# EAGLE design Power Link (EAGLE 9.7.0)
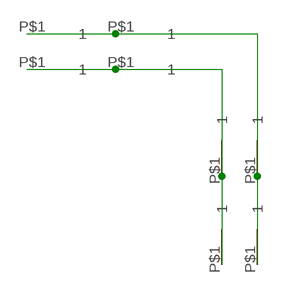
[diagram p0: schematic, sheet 1]

## Parts
PIN1  0945-0-15-20-09-14-11-0  [MILL_MAX_0945_SMD]
PIN2  0945-0-15-20-09-14-11-0  [MILL_MAX_0945_SMD]
PIN3  0945-0-15-20-09-14-11-0  [MILL_MAX_0945_SMD]
PIN4  0945-0-15-20-09-14-11-0  [MILL_MAX_0945_SMD]
PIN5  0945-0-15-20-09-14-11-0  [MILL_MAX_0945_SMD]
PIN6  0945-0-15-20-09-14-11-0  [MILL_MAX_0945_SMD]
PIN7  0945-0-15-20-09-14-11-0  [MILL_MAX_0945_SMD]
PIN8  0945-0-15-20-09-14-11-0  [MILL_MAX_0945_SMD]

## Nets
N$1: PIN1.P$1 PIN3.P$1 PIN5.P$1 PIN7.P$1
N$2: PIN2.P$1 PIN4.P$1 PIN6.P$1 PIN8.P$1

## Library data of the parts
PIN1-PIN8 = MILL_MAX_0945_SMD:0945-0-15-20-09-14-11-0: Surface Mount Spring-Loaded Pin; DATASHEET: https://www.mill-max.com/assets/pdfs/0945.pdf; MANUFACTURER: Mill-Max; MPN: 0945-0-15-20-09-14-11-0

## Board
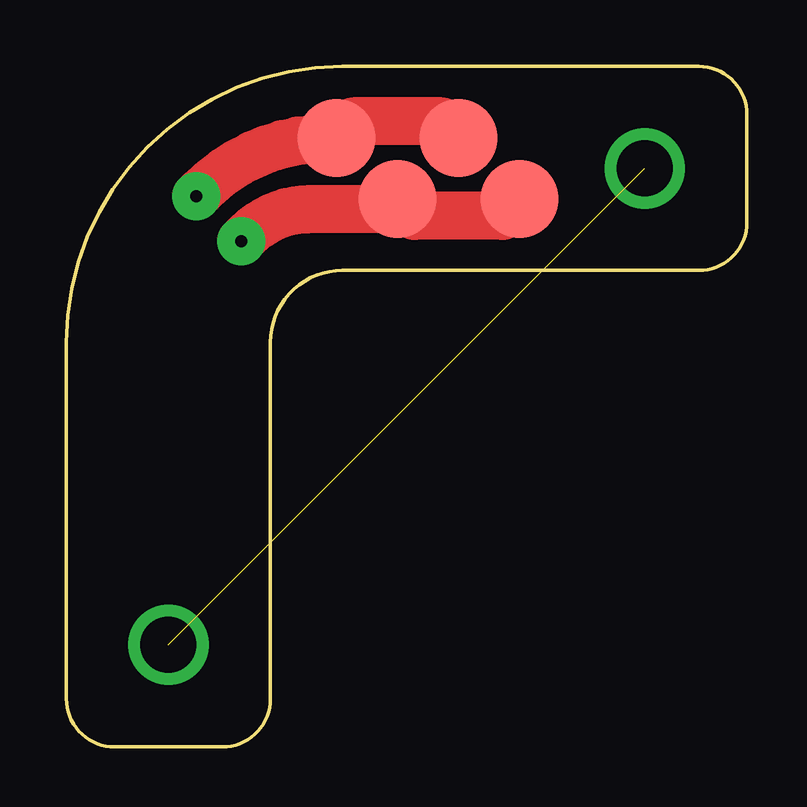
[diagram p1: board, top side]
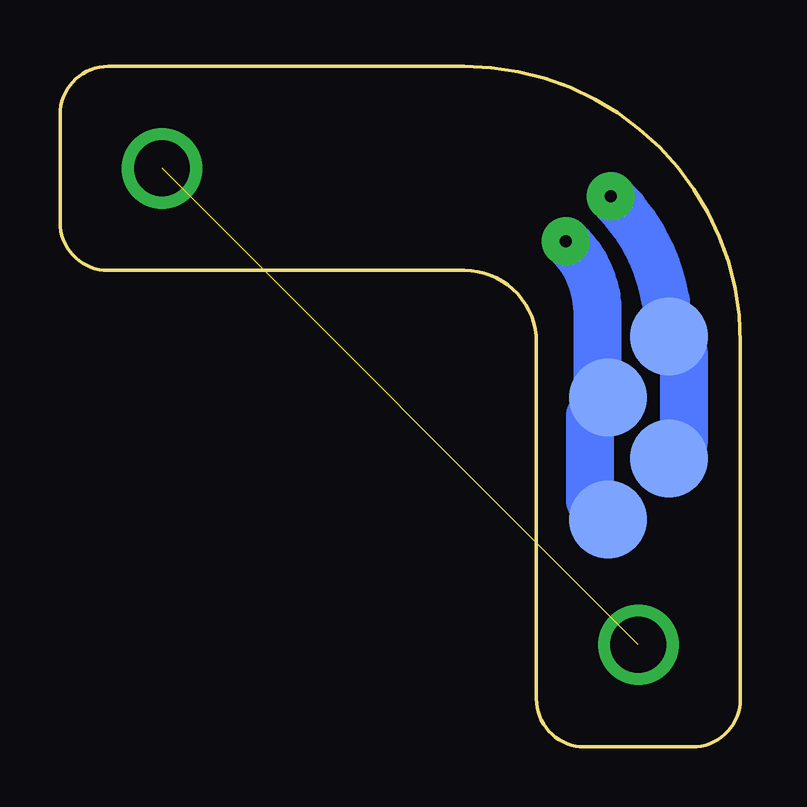
[diagram p2: board, bottom side, seen from below]

Size 28.35 x 28.35 mm. Coordinates in mm from the lower left corner, seen from the top.
Outline: 11.5,19.85 26.35,19.85 arc90 28.35,21.85 28.35,26.35 arc90 26.35,28.35 11.5,28.35 arc90 0,16.85 0,2 arc90 2,0 6.5,0 arc90 8.5,2 8.5,16.85 arc-90 11.5,19.85
Copper layers (1*16): Top 0.035mm / dielectric 1.5mm / Bottom 0.035mm
Design rules "Fusion Electronics Design Rules": minimum track width 6mil, minimum drill 0.35mm, track to track 6mil, track to pad 6mil, pad to pad 6mil, via to via 6mil, smd to smd 6mil, copper to edge 40mil, drill to drill 6mil, minimum pad ring 10mil, minimum via ring 8mil, stop-mask expansion 4mil, vias tented up to drill 9999mil, thermal gap 10mil

### Footprints (pad centres in the part's own frame; a part is rotated, then mirrored left to right if it is on the bottom)
MILL_MAX_0945_SMD = smd 3.25 x 3.25: P$1 0,0

### Placement (x,y rotation side)
PIN1  11.25,25.37 0 top
PIN2  13.79,22.83 0 top
PIN3  16.33,25.37 0 top
PIN4  18.87,22.83 0 top
PIN5  2.98,17.1 180 bottom
PIN6  5.52,14.56 180 bottom
PIN7  2.98,12.02 180 bottom
PIN8  5.52,9.48 180 bottom

### Tracks (layer width: path | path; a pad name or v marks a point on that pad's centre or on a via)
N$1  (via drill 0.5 pad 2)
  Top 2: PIN1.P$1 11.94,26.06 15.64,26.06 PIN3.P$1 | PIN1.P$1 | v5.4,22.95 5.59,23.14 arc-45 10.98,25.37 PIN1.P$1
  Bottom 2: PIN5.P$1 2.37,16.49 2.37,12.63 PIN7.P$1 | PIN5.P$1 | PIN5.P$1 2.98,17.17 arc-45 5.36,22.91 v5.4,22.95
N$2  (via drill 0.5 pad 2)
  Top 2: PIN4.P$1 18.16,22.12 14.49,22.12 PIN2.P$1 13.37,22.41 10.14,22.41 arc45 7.52,21.32 v7.28,21.08
  Bottom 2: PIN8.P$1 6.28,10.24 6.28,13.81 PIN6.P$1 5.95,14.99 5.95,18.09 arc-45 7.12,20.92 v7.28,21.08
S$1  (via drill 2.33)  (1 unrouted)
  other vias: 24.1,24.1 4.25,4.25